# Altium schematic sheet [04] - BATTERIES WITH PROTECTION.SchDoc
size A4; Projectnumber: OWN-000; Size: A4; Contact: datasystem.pl
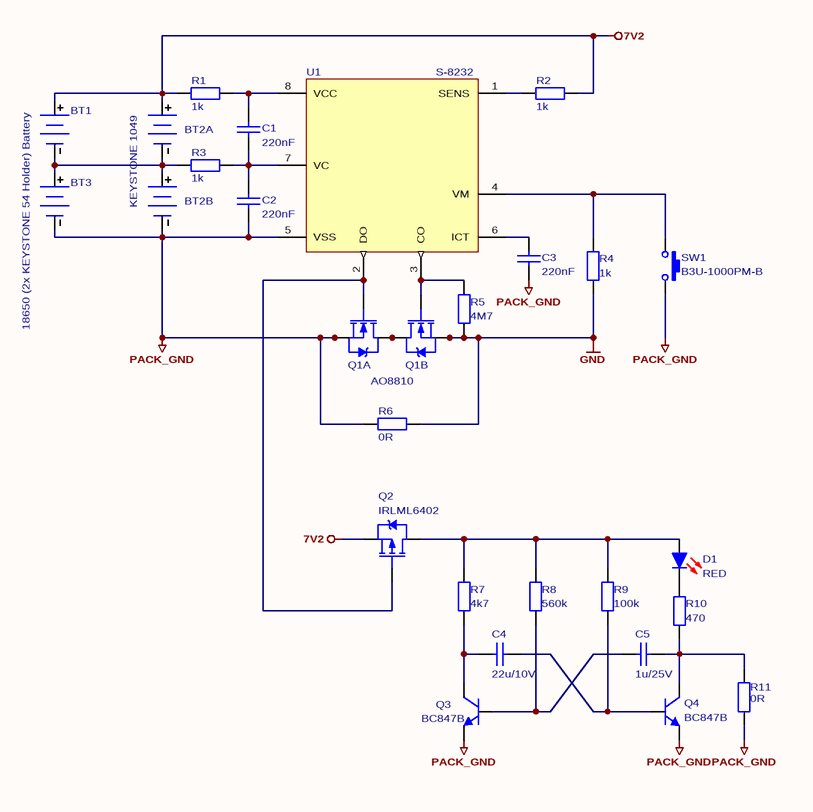
[diagram p0: [04] - BATTERIES WITH PROTECTION.SchDoc]

## Parts
BT1  18650 (2x KEYSTONE 54 Holder) Battery  [KEYSTONE_54_W_18650]  (value not drawn)
BT2  KEYSTONE 1049  [KEYSTONE_1049]  (parts A,B of 2)  (no BOM)
BT3  18650 (2x KEYSTONE 54 Holder) Battery  [KEYSTONE_54_W_18650]
C1  220nF  [C0805]
C2  220nF  [C0805]
C3  220nF  [C0805]
C4  22u/10V  [C0805]
C5  1u/25V  [C0805]
D1  RED  [LED0805R]
Q1  AO8810  [TSSOP8]  (parts A,B of 2)
Q2  IRLML6402  [SOT-23]
Q3  BC847B  [SOT-23]
Q4  BC847B  [SOT-23]
R1  1k  [R0805]
R2  1k  [R0805]
R3  1k  [R0805]
R4  1k  [R0805]
R5  4M7  [R0805]
R6  0R  [R0805]
R7  4k7  [R0805]
R8  560k  [R0805]
R9  100k  [R0805]
R10  470  [R0805]
R11  0R  [R0805]
SW1  B3U-1000PM-B  [B3U-1000PM-B]
U1  S-8232  [TSSOP8]

## Nets
7V2: BT1.1(+) BT2.1(+) Q2.2(S) R1.1 R2.2
GND: Q1.6(S2) Q1.7(S2) R4.2 R5.2 R6.1
PACK_GND: BT2.3(-) BT3.2(-) C2.1 C3.1 Q1.2(S1) Q1.3(S1) Q3.2(E) Q4.2(E) R6.2 R11.1 SW1.2 U1.5(VSS)
NetBT1_2: BT1.2(-) BT2.2(-) BT2.4(+) BT3.1(+) R3.1
NetC1_1: C1.1 C2.2 R3.2 U1.7(VC)
NetC1_2: C1.2 R1.2 U1.8(VCC)
NetC3_2: C3.2 U1.6(ICT)
NetC4_1: C4.1 Q3.3(C) R7.2
NetC4_2: C4.2 Q4.1(B) R9.2
NetC5_1: C5.1 Q3.1(B) R8.2
NetC5_2: C5.2 Q4.3(C) R10.2 R11.2
NetD1_1: D1.1(A) Q2.3(D) R7.1 R8.1 R9.1
NetD1_2: D1.2(K) R10.1
NetQ1_1: Q1.1(D1/D2) Q1.8(D1/D3)
NetQ1_4: Q1.4(G1) Q2.1(G) U1.2(DO)
NetQ1_5: Q1.5(G2) R5.1 U1.3(CO)
NetR2_1: R2.1 U1.1(SENS)
NetR4_1: R4.1 SW1.1 U1.4(VM)

## Notes on the sheet
- REV:
- A  P  P  R  O  V  E  D
- /
- Lodz University of Technology
- ul. Wolczanska 211/215
- 90-924 LODZ, POLAND
- Institute of Electronics
- Project name:
- Title:
- Author:
- Verified by:

## Library data of the parts
BT1 BT3 = 18650: Published: 24-Mar-1999; Revision: July-2002: Re-released for DXP Platform.; Publisher: Altium Limited
BT2 = Keystone 1049: 2x 18650 LiPo Acu in the KEYSTONE 1049 Holder; Published: 14-Sep-2006
C1-C5 = Cap: Capacitor; ComponentLink1Description: datasheet; ComponentLink2Description: supplier
  C1-C3: Value: 220nF
  C4: Value: 22u/10V
  C5: Value: 1u/25V
D1 = LED_RED: RED LED; Published: 04-Apr-2006
Q1 = AO8810: Dual Common Drain N-Channel MOSFET: Vds=20V, Rdson<20mR@4,5V, Id=7A; Published: 20-Mar-2006; Package Reference: TSOP6 (SOT23-6); Supplier 1: TME; Supplier Part Number 1: AO8810
Q2 = IRLML6402: P-Channel; -20V, -3.7A, 1.3W; HEXFET Power MOS-FET
Q3 Q4 = BC847B: NPN General Purpose Transistor (VCE=45V, IC=100mA, HFE=200-450); PowerRating: 250mW; VCEO: 45V; IC: 100mA; HFE: 200-450; Supplier 1: TME; Supplier 2: TME; Supplier 3: TME; Supplier 4: Farnell; Supplier 5: Farnell; Supplier 6: Farnell; Supplier 7: Farnell; Supplier 8: Farnell; Supplier 9: Farnell; Supplier Part Number 1: BC847B.215; Supplier Part Number 2: BC847B-DIO; Supplier Part Number 3: BC847B.235; Supplier Part Number 4: 1562449; Supplier Part Number 5: 1081232; Supplier Part Number 6: 1081232RL; Supplier Part Number 7: 1773608RL; Supplier Part Number 8: 2336781; Supplier Part Number 9: 1574343
R1-R11 = Res: Resistor; Published: 19-Feb-2006; ComponentLink1Description: datasheet; ComponentLink2Description: supplier
  R1-R4: Value: 1k
  R5: Value: 4M7
  R6 R11: Value: 0R
  R7: Value: 4k7
  R8: Value: 560k
  R9: Value: 100k
  R10: Value: 470
SW1 = B3U-1000PM-B: OMRON Ultra-small Tactile Switch - 12V/50mA
U1 = S-8232: Battery Protection IC For 2-Serial-Cell Pack